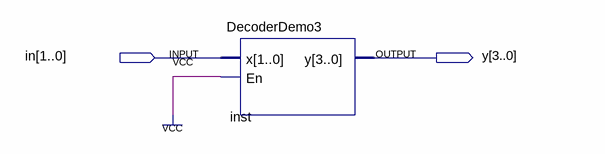
[diagram p0: schematic sheet]
// Quartus schematic Block1.bdf as structural Verilog: 1 symbols, 2 pins
module Block1 (
  input  [1:0] in,
  output [3:0] y
);

  DecoderDemo3 inst (.x(in), .En(1'b1), .y(y));
endmodule
